# Altium schematic sheet Engine.SchDoc
size Letter; SheetNumber: 4; SheetTotal: 4
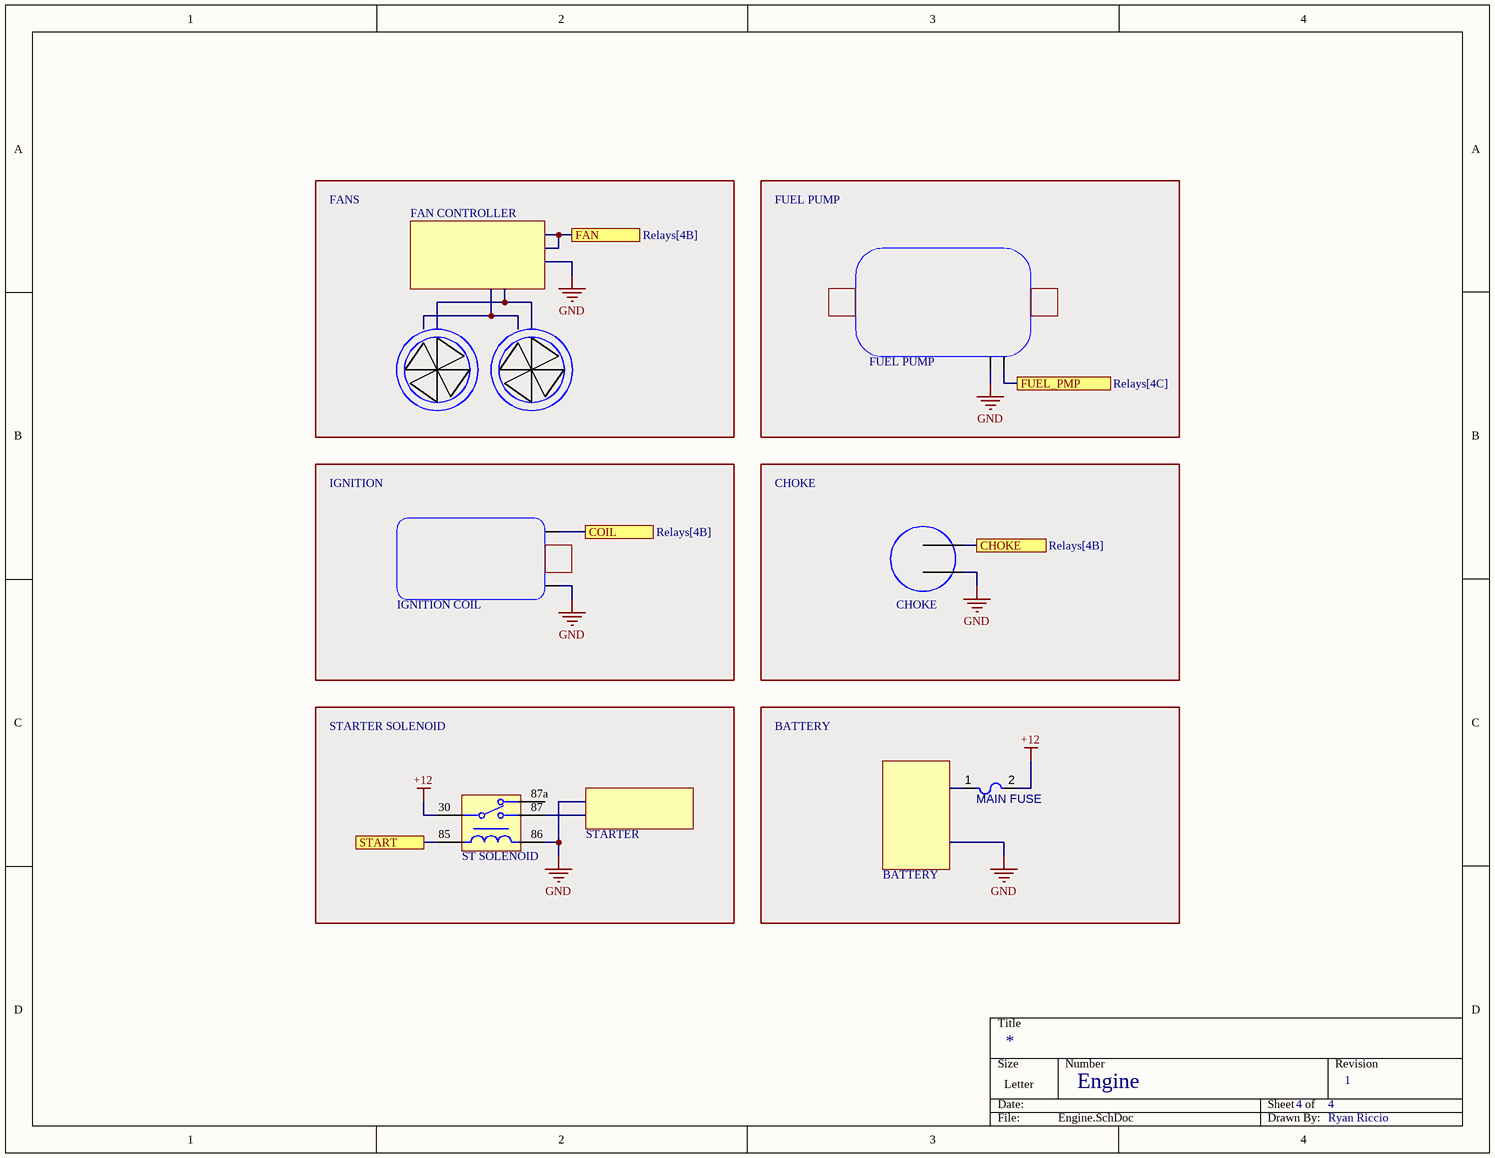
[diagram p0: Engine.SchDoc]

## Parts
F?  MAIN FUSE  [LFUS-467_V]
K?  ST SOLENOID  [FP-CB1-P-12V-MFG]

## Ports
CHOKE (see Relays[4B]), COIL (see Relays[4B]), FAN (see Relays[4B]), FUEL_PMP (see Relays[4C]), START (see Relays[1A], Switches[2D])

## Nets
+12: F?.2 K?.30
GND: K?.86
START: K?.85 ; port START

Not connected (* = marked no-connect by the designer): F? 1; K? 87 87a

## Notes on the sheet
- FANS
- FAN CONTROLLER
- FUEL PUMP
- IGNITION
- CHOKE
- IGNITION COIL
- STARTER SOLENOID
- BATTERY
- STARTER
- Engine
- 1
- Ryan Riccio

## Library data of the parts
F? = CMP-005-00011-2: Fast Acting Fuse, 2 A, 32 V, -55 to 90 degC, 2-Pin SMD, RoHS, Tape and Reel; Current Rating: 2A; Case/Package: LFUS-467; Mounting Technology: SurfaceMount; Pins: 2
K? = CMP-008-00005-1: Relays 12VDC 103Ohm 40(NO)/30(NC)A SPDT(26mm 22mm 26mm) THT Automotive Relay Automotive